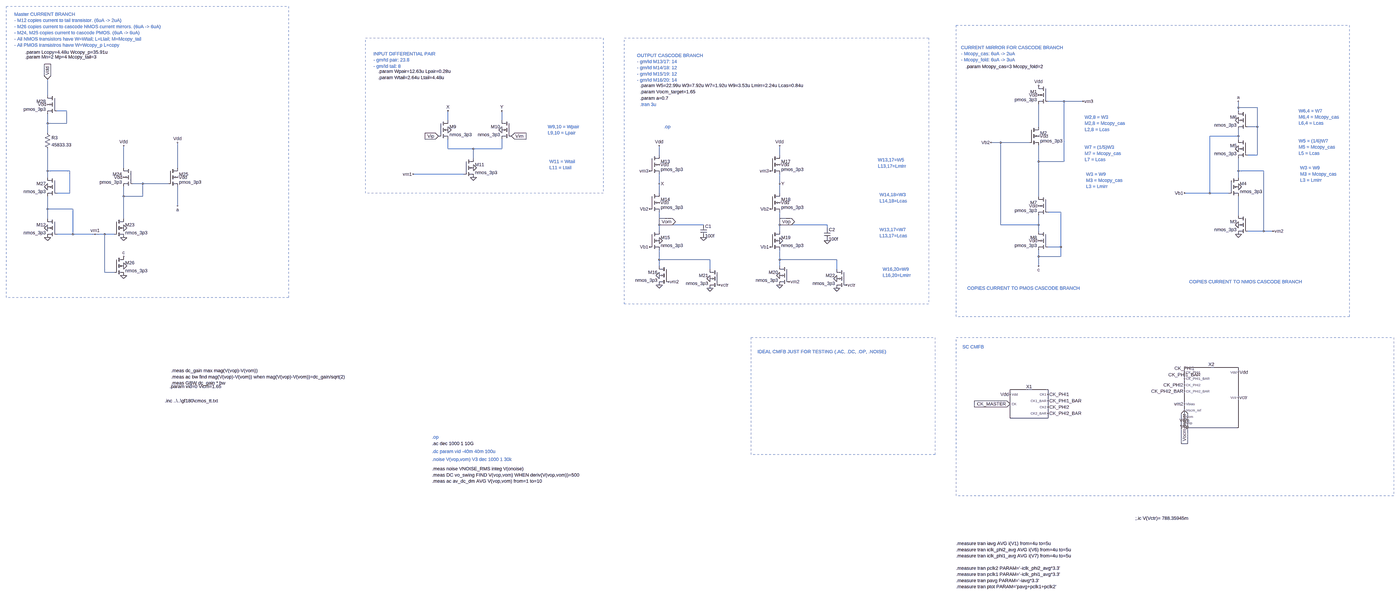
[diagram p0: schematic ota_v4.asc, whole sheet]
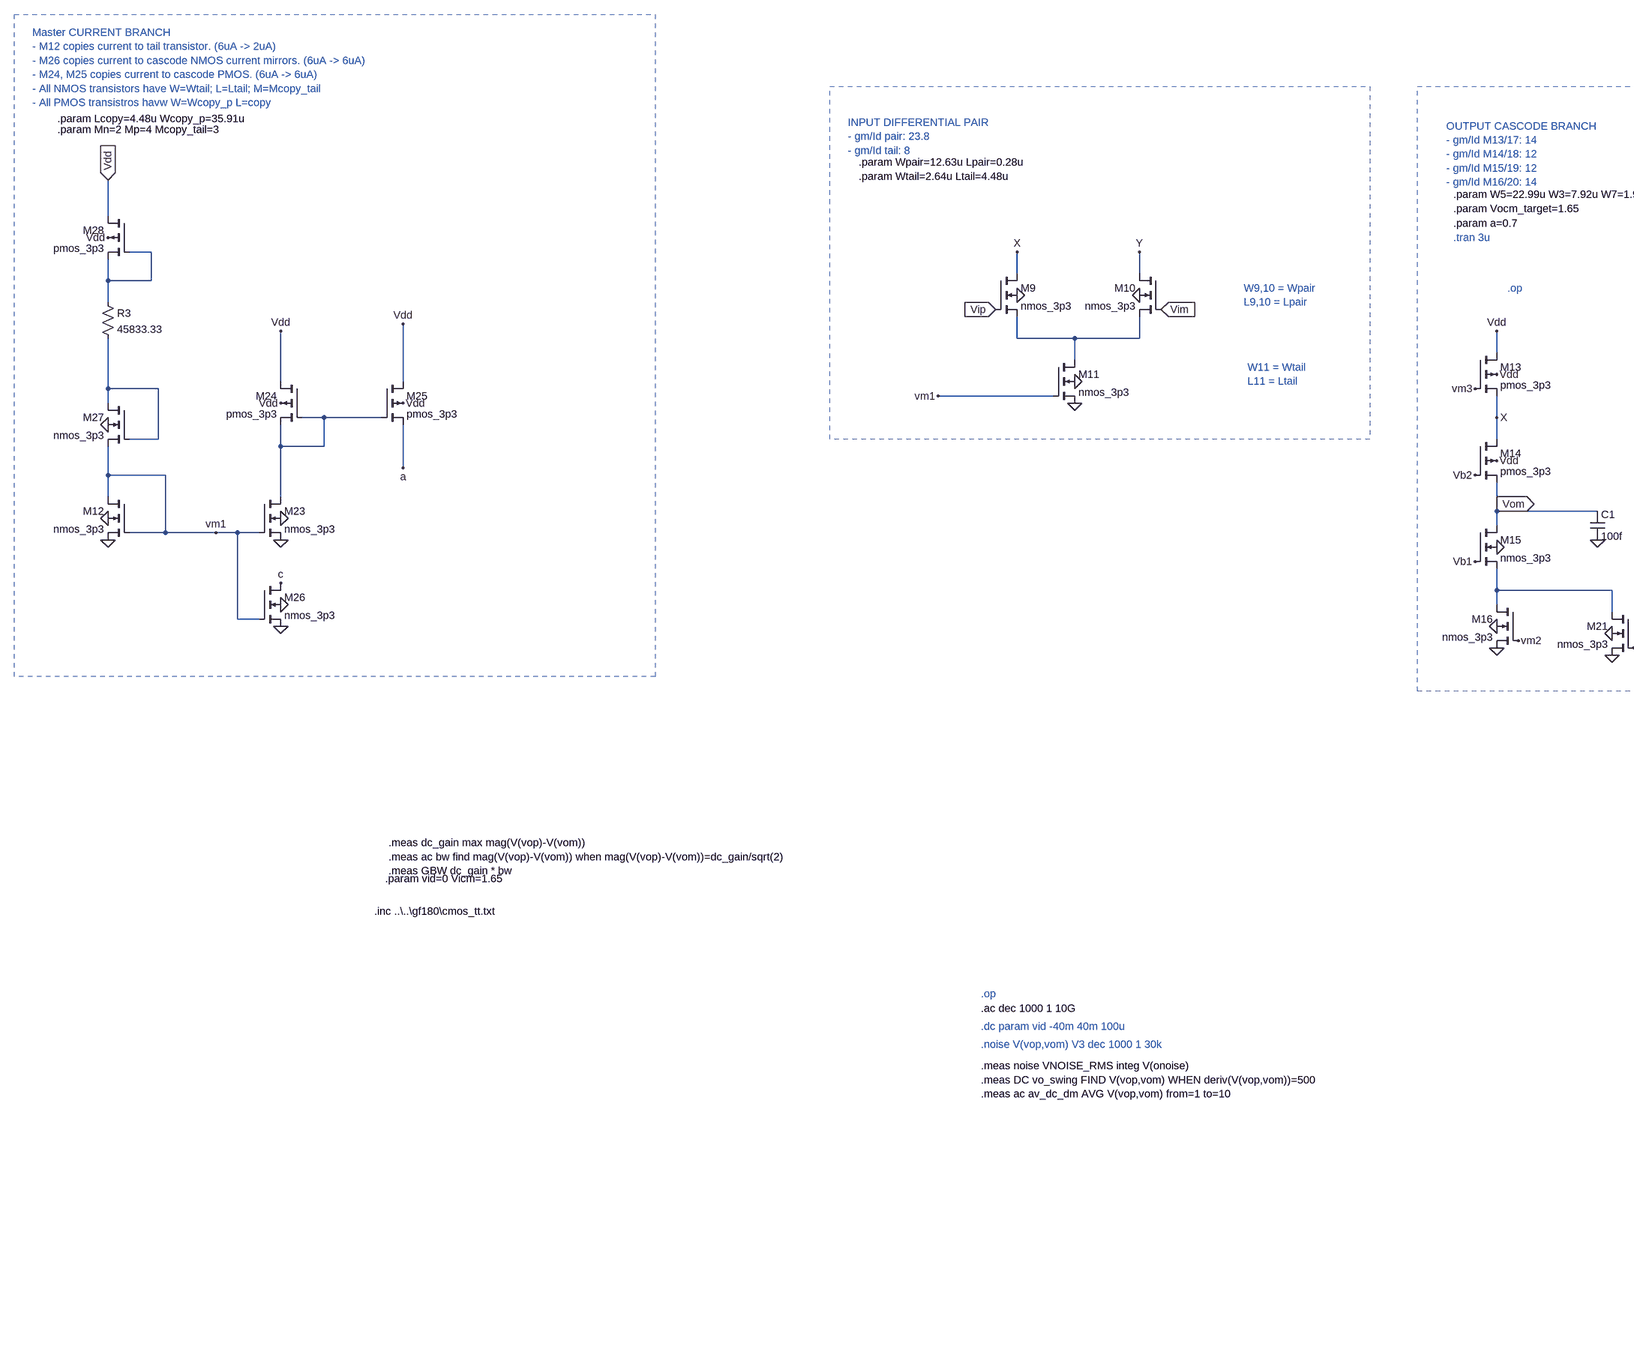
[diagram p1: schematic ota_v4.asc, part, row 1 of 1, column 1 of 2]
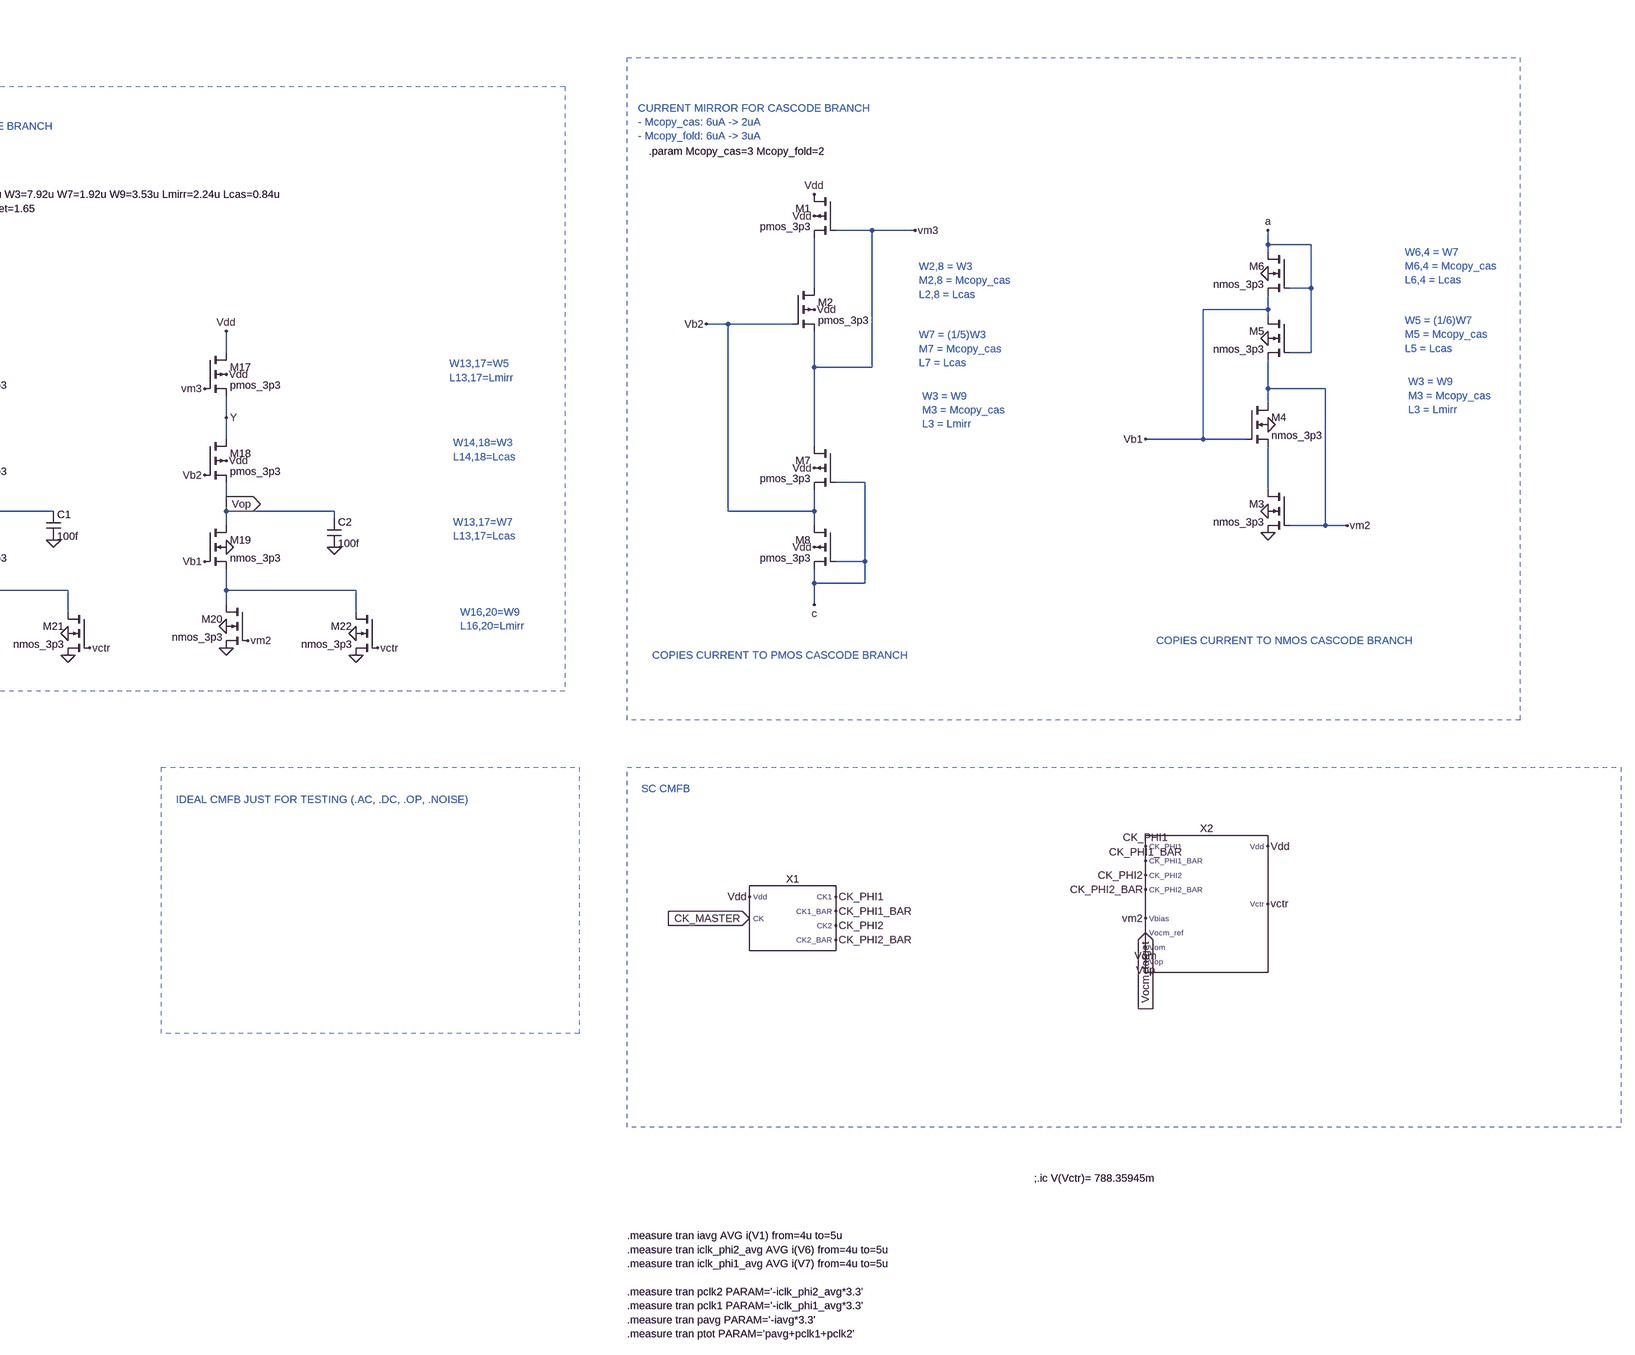
[diagram p2: schematic ota_v4.asc, part, row 1 of 1, column 2 of 2]
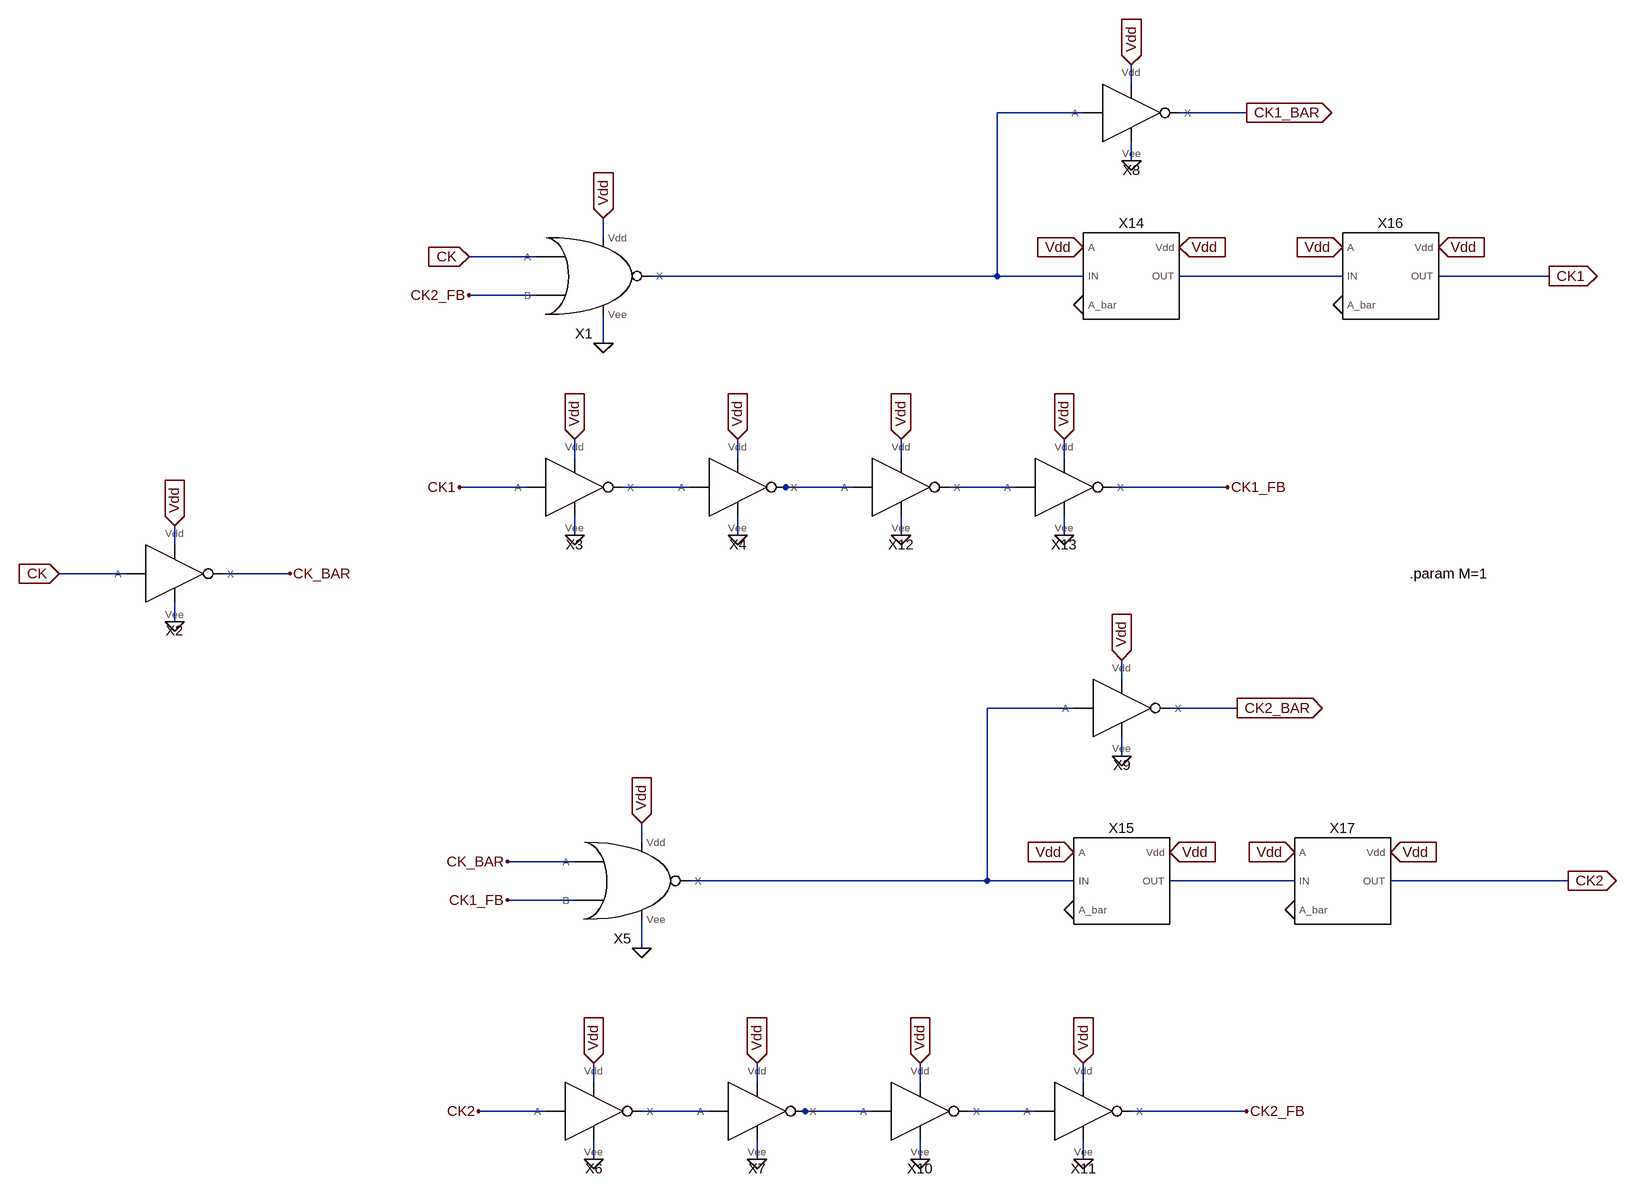
[diagram p3: sub-circuit phase_gen.asc]
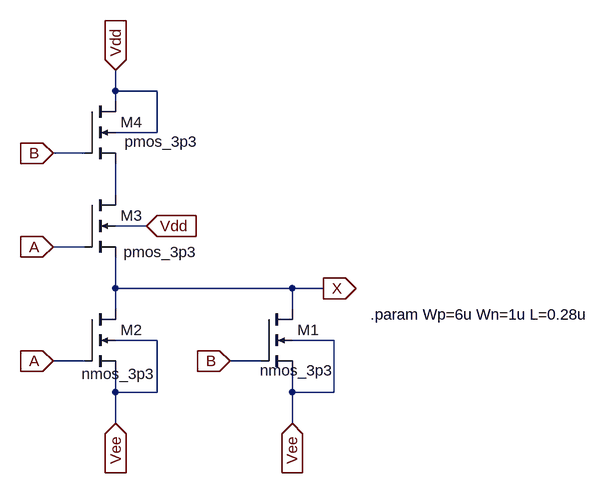
[diagram p4: sub-circuit nor2x1.asc]
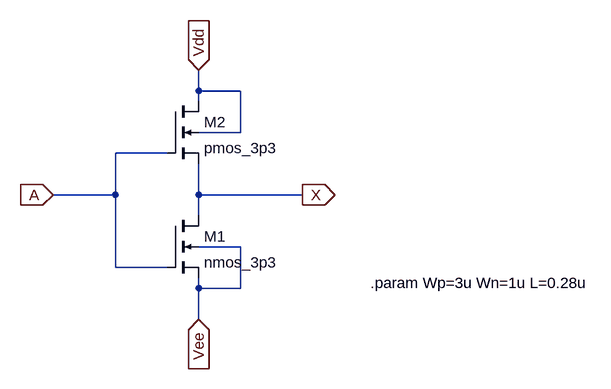
[diagram p5: sub-circuit invx1.asc]
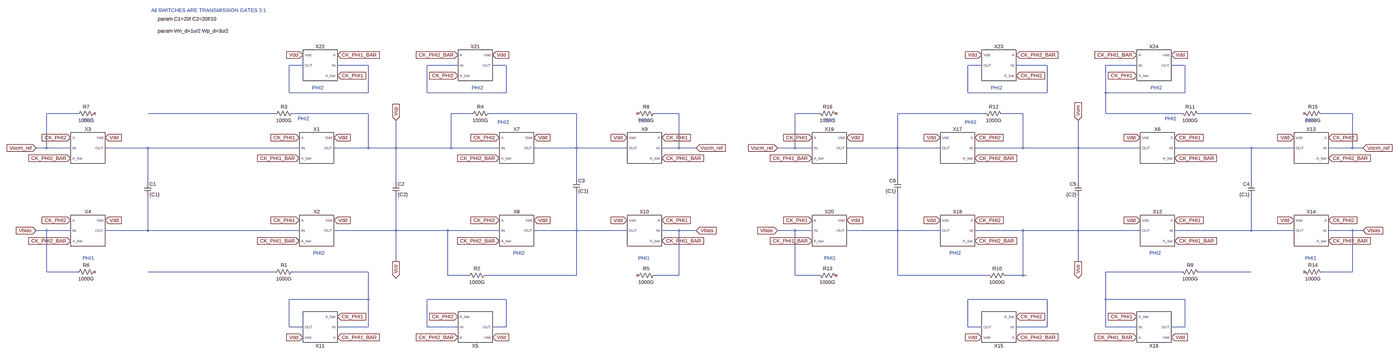
[diagram p6: sub-circuit cs_cmfb_v2.asc, whole sheet]
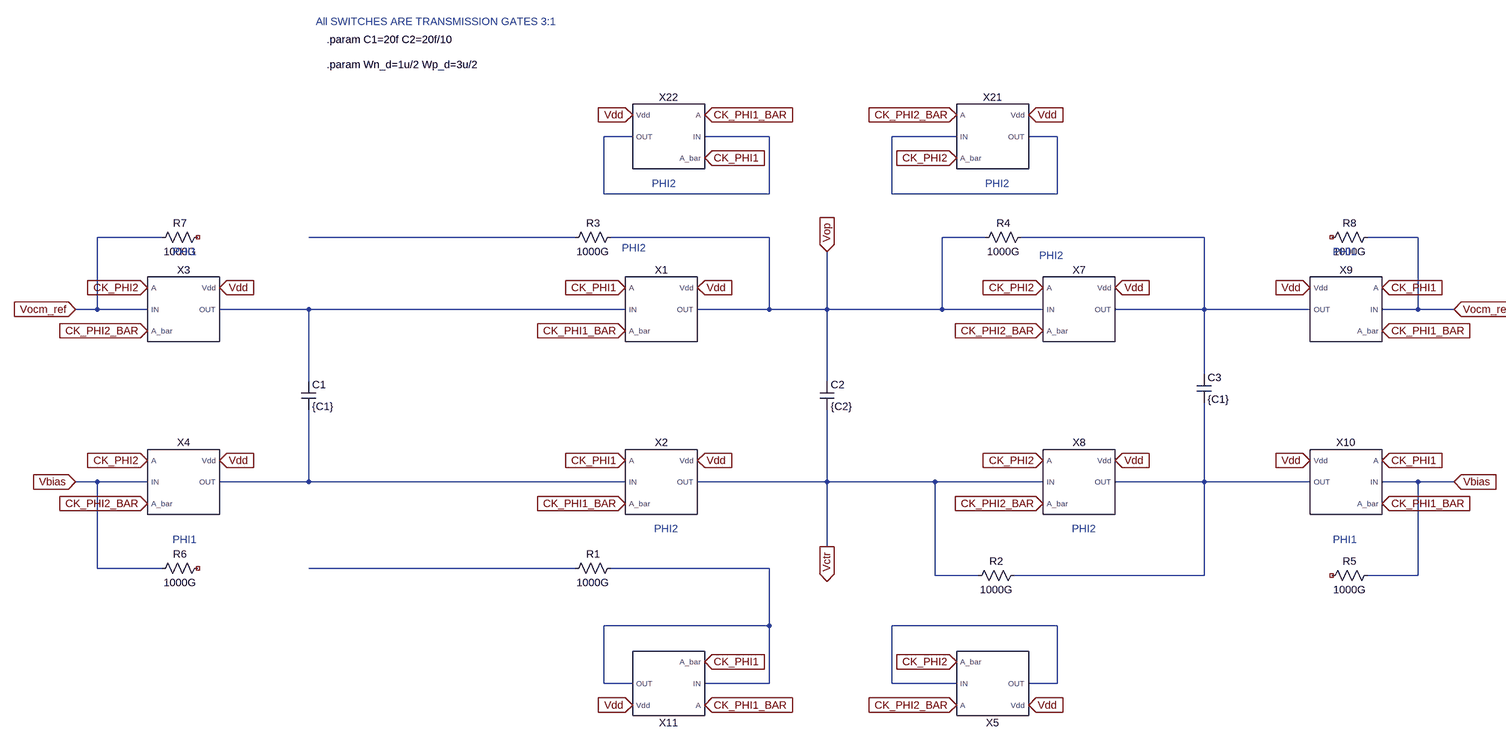
[diagram p7: sub-circuit cs_cmfb_v2.asc, part, row 1 of 1, column 1 of 2]
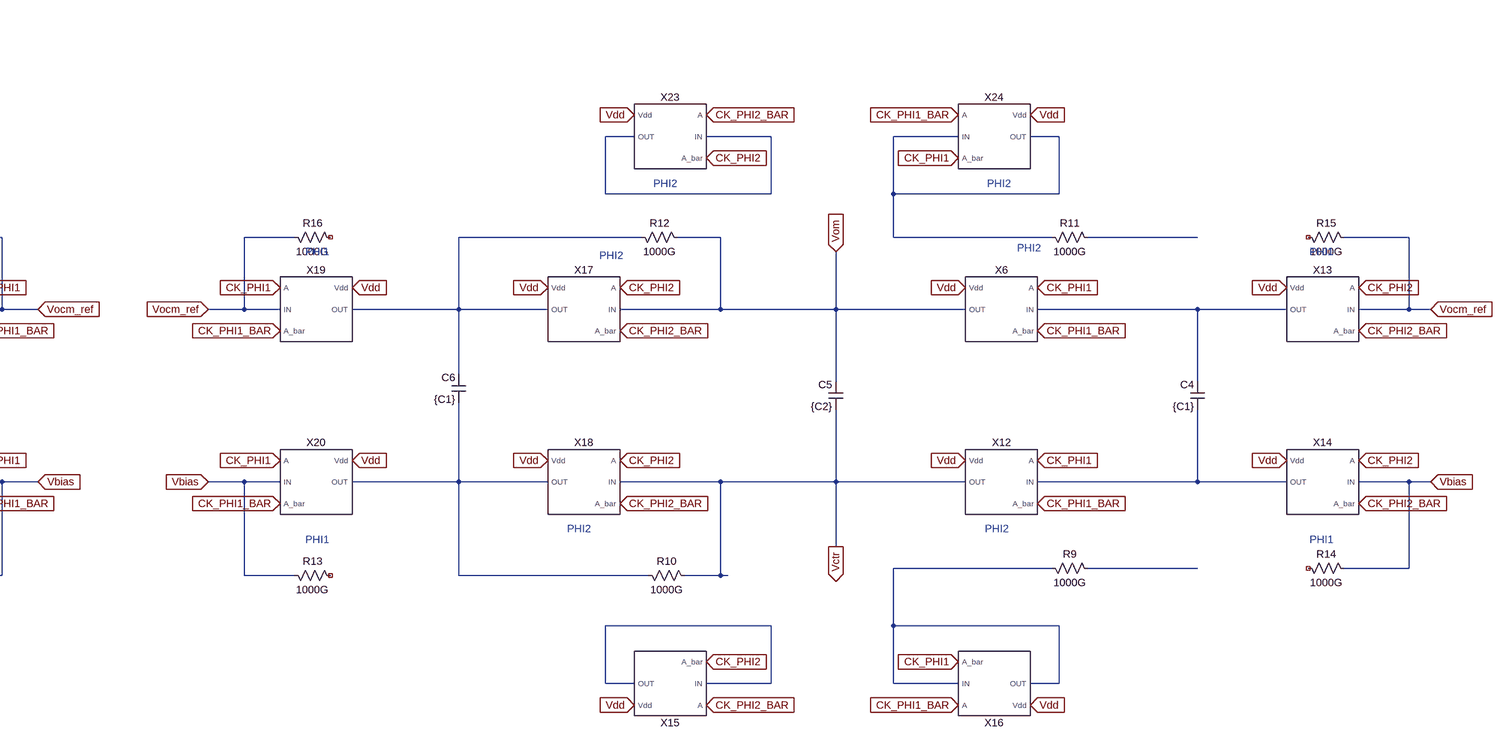
[diagram p8: sub-circuit cs_cmfb_v2.asc, part, row 1 of 1, column 2 of 2]
ota_v4.asc, the LTspice schematic file:
Version 4
SHEET 1 2504 3056
WIRE -7104 -480 -7104 -560
WIRE -1328 -448 -1408 -448
WIRE -1232 -448 -1328 -448
WIRE -448 -416 -448 -448
WIRE -352 -416 -448 -416
WIRE -7008 -400 -7056 -400
WIRE -448 -400 -448 -416
WIRE -5040 -352 -5040 -400
WIRE -4768 -352 -4768 -400
WIRE -7104 -336 -7104 -384
WIRE -7008 -336 -7008 -400
WIRE -7008 -336 -7104 -336
WIRE -1456 -320 -1456 -432
WIRE -352 -320 -352 -416
WIRE -352 -320 -400 -320
WIRE -7104 -288 -7104 -336
WIRE -448 -272 -448 -304
WIRE -448 -272 -592 -272
WIRE -448 -256 -448 -272
WIRE -1648 -240 -1696 -240
WIRE -1504 -240 -1648 -240
WIRE -5040 -208 -5040 -256
WIRE -4912 -208 -5040 -208
WIRE -4768 -208 -4768 -256
WIRE -4768 -208 -4912 -208
WIRE -3824 -176 -3824 -224
WIRE -3216 -176 -3216 -224
WIRE -352 -176 -352 -320
WIRE -352 -176 -400 -176
WIRE -4912 -160 -4912 -208
WIRE -1456 -144 -1456 -224
WIRE -1328 -144 -1328 -448
WIRE -1328 -144 -1456 -144
WIRE -6720 -112 -6720 -224
WIRE -6448 -112 -6448 -240
WIRE -7104 -96 -7104 -208
WIRE -6992 -96 -7104 -96
WIRE -448 -96 -448 -160
WIRE -320 -96 -448 -96
WIRE -4960 -80 -5216 -80
WIRE -7104 -64 -7104 -96
WIRE -448 -64 -448 -96
WIRE -6624 -32 -6672 -32
WIRE -6496 -32 -6624 -32
WIRE -3824 -32 -3824 -80
WIRE -3216 -32 -3216 -80
WIRE -6992 16 -6992 -96
WIRE -6992 16 -7056 16
WIRE -3824 16 -3824 -32
WIRE -3216 16 -3216 -32
WIRE -592 16 -592 -272
WIRE -592 16 -720 16
WIRE -496 16 -592 16
WIRE -6720 32 -6720 -16
WIRE -6624 32 -6624 -32
WIRE -6624 32 -6720 32
WIRE -1456 32 -1456 -144
WIRE -6448 80 -6448 -16
WIRE -7104 96 -7104 32
WIRE -6976 96 -7104 96
WIRE -1344 112 -1408 112
WIRE -448 128 -448 32
WIRE -7104 144 -7104 96
WIRE -6720 144 -6720 32
WIRE -3824 160 -3824 112
WIRE -3216 160 -3216 112
WIRE -3824 176 -3824 160
WIRE -3600 176 -3824 176
WIRE -3216 176 -3216 160
WIRE -2976 176 -3216 176
WIRE -1648 176 -1648 -240
WIRE -1456 176 -1456 128
WIRE -1456 176 -1648 176
WIRE -2976 192 -2976 176
WIRE -3824 208 -3824 176
WIRE -3216 208 -3216 176
WIRE -1456 208 -1456 176
WIRE -320 208 -320 -96
WIRE -320 208 -400 208
WIRE -272 208 -320 208
WIRE -6976 224 -6976 96
WIRE -6976 224 -7056 224
WIRE -6864 224 -6976 224
WIRE -6816 224 -6864 224
WIRE -6768 224 -6816 224
WIRE -1344 288 -1344 112
WIRE -1344 288 -1408 288
WIRE -1456 336 -1456 304
WIRE -1344 336 -1344 288
WIRE -1344 336 -1456 336
WIRE -3824 352 -3824 304
WIRE -3568 352 -3824 352
WIRE -3216 352 -3216 304
WIRE -2928 352 -3216 352
WIRE -3824 384 -3824 352
WIRE -3216 384 -3216 352
WIRE -1456 384 -1456 336
WIRE -3568 400 -3568 352
WIRE -2928 400 -2928 352
WIRE -6816 416 -6816 224
WIRE -6768 416 -6816 416
FLAG -1456 -480 Vdd
FLAG -1456 -528 Vdd
FLAG -1456 -272 Vdd
FLAG -1232 -448 vm3
FLAG -1696 -240 Vb2
FLAG -1456 384 c
FLAG -448 224 0
FLAG -448 176 0
FLAG -272 208 vm2
FLAG -448 -16 0
FLAG -720 16 Vb1
FLAG -448 -448 a
FLAG -448 -208 0
FLAG -448 -352 0
FLAG -1456 80 Vdd
FLAG -1456 256 Vdd
FLAG -4912 -64 0
FLAG -5040 -304 0
FLAG -4768 -304 0
FLAG -4912 -112 0
FLAG -7104 240 0
FLAG -7104 192 0
FLAG -5088 -272 Vip
IOPIN -5088 -272 In
FLAG -4720 -272 Vim
IOPIN -4720 -272 In
FLAG -3824 -224 Vdd
FLAG -3824 480 0
FLAG -3824 432 0
FLAG -3824 256 0
FLAG -3824 -32 X
FLAG -3824 64 Vdd
FLAG -3872 288 Vb1
FLAG -3872 96 Vb2
FLAG -3824 -128 Vdd
FLAG -3216 -224 Vdd
FLAG -3216 480 0
FLAG -3216 432 0
FLAG -3216 256 0
FLAG -3216 -32 Y
FLAG -3216 64 Vdd
FLAG -3264 288 Vb1
FLAG -3264 96 Vb2
FLAG -3216 -128 Vdd
FLAG -3168 464 vm2
FLAG -3776 464 vm2
FLAG -3264 -96 vm3
FLAG -3872 -96 vm3
FLAG -3216 160 Vop
IOPIN -3216 160 Out
FLAG -3824 160 Vom
IOPIN -3824 160 Out
FLAG -5040 -400 X
FLAG -4768 -400 Y
FLAG -6864 224 vm1
FLAG -3568 496 0
FLAG -3568 448 0
FLAG -3520 480 vctr
FLAG -2928 496 0
FLAG -2928 448 0
FLAG -2880 480 vctr
FLAG -3600 240 0
FLAG -2976 256 0
FLAG -5216 -80 vm1
FLAG -6720 240 0
FLAG -6720 192 0
FLAG -6720 -64 Vdd
FLAG -6720 -224 Vdd
FLAG -6448 -64 Vdd
FLAG -6448 -240 Vdd
FLAG -6448 80 a
FLAG -6720 432 0
FLAG -6720 384 0
FLAG -6720 336 c
FLAG -7104 -560 Vdd
IOPIN -7104 -560 In
FLAG -7104 -16 0
FLAG -7104 -432 Vdd
FLAG -1600 1088 Vdd
FLAG -1600 1136 CK_MASTER
IOPIN -1600 1136 In
FLAG -1408 1088 CK_PHI1
FLAG -1408 1152 CK_PHI2
FLAG -1408 1120 CK_PHI1_BAR
FLAG -1408 1184 CK_PHI2_BAR
FLAG -720 976 CK_PHI1
FLAG -720 1040 CK_PHI2
FLAG -720 1008 CK_PHI1_BAR
FLAG -720 1072 CK_PHI2_BAR
FLAG -720 1232 Vop
FLAG -720 1200 Vom
FLAG -720 1168 Vocm_target
IOPIN -720 1168 In
FLAG -720 1136 vm2
FLAG -448 1104 vctr
FLAG -448 976 Vdd
DATAFLAG -5056 -80 ""
DATAFLAG -1600 -240 ""
DATAFLAG -1344 -448 ""
DATAFLAG -640 16 ""
DATAFLAG -336 208 ""
DATAFLAG -3728 176 ""
DATAFLAG -4896 -208 ""
DATAFLAG -3664 352 ""
DATAFLAG -3344 192 "Id(M18)"
DATAFLAG -3360 -128 "Id(M17)"
DATAFLAG -4752 -112 "Id(M11)"
DATAFLAG -5168 -384 "Id(M9)"
DATAFLAG -4672 -400 "Id(M9)"
DATAFLAG -3744 -16 "V(X)"
DATAFLAG -3344 384 "Id(M20)"
DATAFLAG -2816 384 "Id(M22)"
DATAFLAG -6976 176 ""
DATAFLAG -6448 48 "Id(M25)"
DATAFLAG -6720 304 "Id(M26)"
DATAFLAG -448 -480 "Id(M6)"
DATAFLAG -1456 432 "Id(M6)"
DATAFLAG -3744 464 ""
SYMBOL pmos4 -1408 -528 M0
SYMATTR InstName M1
SYMATTR Value pmos_3p3
SYMATTR Value2 l='Lmirr' w='W5' m=Mcopy_fold
SYMBOL pmos4 -1504 -320 R0
SYMATTR InstName M2
SYMATTR Value pmos_3p3
SYMATTR Value2 l='Lcas' w='W3' m=Mcopy_cas
SYMBOL nmos4 -400 128 M0
SYMATTR InstName M3
SYMATTR Value nmos_3p3
SYMATTR Value2 l='Lmirr' w='W9' m=Mcopy_cas
SYMBOL nmos4 -496 -64 R0
SYMATTR InstName M4
SYMATTR Value nmos_3p3
SYMATTR Value2 l='Lcas' w='W7' m=Mcopy_cas
SYMBOL nmos4 -400 -256 M0
SYMATTR InstName M5
SYMATTR Value nmos_3p3
SYMATTR Value2 l='Lcas' w='(1/6)*W7' m=Mcopy_cas
SYMBOL nmos4 -400 -400 M0
SYMATTR InstName M6
SYMATTR Value nmos_3p3
SYMATTR Value2 l='Lcas' w='W7' m=Mcopy_cas
SYMBOL pmos4 -1408 32 M0
SYMATTR InstName M7
SYMATTR Value pmos_3p3
SYMATTR Value2 l='Lcas' w='(1/5)*W3' m=Mcopy_cas
SYMBOL pmos4 -1408 208 M0
SYMATTR InstName M8
SYMATTR Value pmos_3p3
SYMATTR Value2 l='Lcas' w='W3' m=Mcopy_cas
SYMBOL nmos4 -5088 -352 R0
SYMATTR InstName M9
SYMATTR Value nmos_3p3
SYMATTR Value2 l='Lpair' w='Wpair' m=1
SYMBOL nmos4 -4720 -352 M0
SYMATTR InstName M10
SYMATTR Value nmos_3p3
SYMATTR Value2 l='Lpair' w='Wpair' m=1
SYMBOL nmos4 -4960 -160 R0
SYMATTR InstName M11
SYMATTR Value nmos_3p3
SYMATTR Value2 l='Ltail' w='Wtail' m=1
SYMBOL nmos4 -7056 144 M0
SYMATTR InstName M12
SYMATTR Value nmos_3p3
SYMATTR Value2 l='Ltail' w='Wtail' m=Mcopy_tail
SYMBOL pmos4 -3872 -176 R0
SYMATTR InstName M13
SYMATTR Value pmos_3p3
SYMATTR Value2 l='Lmirr' w='W5' m=1
SYMBOL pmos4 -3872 16 R0
SYMATTR InstName M14
SYMATTR Value pmos_3p3
SYMATTR Value2 l='Lcas' w='W3' m=1
SYMBOL nmos4 -3872 208 R0
SYMATTR InstName M15
SYMATTR Value nmos_3p3
SYMATTR Value2 l='Lcas' w='W7'
SYMBOL nmos4 -3776 384 M0
SYMATTR InstName M16
SYMATTR Value nmos_3p3
SYMATTR Value2 l='Lmirr' w='a*W9'
SYMBOL pmos4 -3264 -176 R0
SYMATTR InstName M17
SYMATTR Value pmos_3p3
SYMATTR Value2 l='Lmirr' w='W5' m=1
SYMBOL pmos4 -3264 16 R0
SYMATTR InstName M18
SYMATTR Value pmos_3p3
SYMATTR Value2 l='Lcas' w='W3' m=1
SYMBOL nmos4 -3264 208 R0
SYMATTR InstName M19
SYMATTR Value nmos_3p3
SYMATTR Value2 l='Lcas' w='W7'
SYMBOL nmos4 -3168 384 M0
SYMATTR InstName M20
SYMATTR Value nmos_3p3
SYMATTR Value2 l='Lmirr' w='a*W9'
SYMBOL nmos4 -3520 400 M0
SYMATTR InstName M21
SYMATTR Value nmos_3p3
SYMATTR Value2 l='Lmirr' w='(1-a)*W9'
SYMBOL nmos4 -2880 400 M0
SYMATTR InstName M22
SYMATTR Value nmos_3p3
SYMATTR Value2 l='Lmirr' w='(1-a)*W9'
SYMBOL cap -3616 176 R0
SYMATTR InstName C1
SYMATTR Value 100f
SYMBOL cap -2992 192 R0
SYMATTR InstName C2
SYMATTR Value 100f
SYMBOL nmos4 -6768 144 R0
SYMATTR InstName M23
SYMATTR Value nmos_3p3
SYMATTR Value2 l='Ltail' w='Wtail' m=Mcopy_tail
SYMBOL pmos4 -6672 -112 M0
SYMATTR InstName M24
SYMATTR Value pmos_3p3
SYMATTR Value2 l='Lcopy' w='Wcopy_p'
SYMBOL pmos4 -6496 -112 R0
SYMATTR InstName M25
SYMATTR Value pmos_3p3
SYMATTR Value2 l='Lcopy' w='Wcopy_p'
SYMBOL nmos4 -6768 336 R0
SYMATTR InstName M26
SYMATTR Value nmos_3p3
SYMATTR Value2 l='Ltail' w='Wtail' m=Mcopy_tail
SYMBOL nmos4 -7056 -64 M0
SYMATTR InstName M27
SYMATTR Value nmos_3p3
SYMATTR Value2 l='Ltail' w=2.64u m=3
SYMBOL pmos4 -7056 -480 M0
SYMATTR InstName M28
SYMATTR Value pmos_3p3
SYMATTR Value2 l='Ltail' w='Wcopy_p'
SYMBOL res -7120 -304 R0
SYMATTR InstName R3
SYMATTR Value 45833.33
SYMBOL PHASE_GEN -1504 1136 R0
SYMATTR InstName X1
SYMBOL CS_CMFB_V2 -592 1104 R0
SYMATTR InstName X2
TEXT -5392 -600 Left 2 !.param Wpair=12.63u Lpair=0.28u
TEXT -5392 -568 Left 2 !.param Wtail=2.64u Ltail=4.48u
TEXT -6488 1048 Left 2 !.param vid=0 Vicm=1.65
TEXT -6512 1120 Left 2 !.inc ..\\..\\gf180\\cmos_tt.txt
TEXT -3800 -320 Left 2 ;.op
TEXT -3920 -528 Left 2 !.param W5=22.99u W3=7.92u W7=1.92u W9=3.53u Lmirr=2.24u Lcas=0.84u
TEXT -3920 -496 Left 2 !.param Vocm_target=1.65
TEXT -3920 -432 Left 2 ;.tran 3u
TEXT -3920 -464 Left 2 !.param a=0.7
TEXT -5120 1336 Left 2 !.ac dec 1000 1 10G
TEXT -5120 1376 Left 2 ;.dc param vid -40m 40m 100u
TEXT -6480 968 Left 2 !.meas dc_gain max mag(V(vop)-V(vom))\n.meas ac bw find mag(V(vop)-V(vom)) when mag(V(vop)-V(vom))=dc_gain/sqrt(2)\n.meas GBW dc_gain * bw
TEXT -7216 -696 Left 2 !.param Lcopy=4.48u Wcopy_p=35.91u
TEXT -7272 -888 Left 2 ;Master CURRENT BRANCH\n- M12 copies current to tail transistor. (6uA -> 2uA)\n- M26 copies current to cascode NMOS current mirrors. (6uA -> 6uA)\n- M24, M25 copies current to cascode PMOS. (6uA -> 6uA)\n- All NMOS transistors have W=Wtail; L=Ltail; M=Mcopy_tail\n- All PMOS transistros havw W=Wcopy_p L=copy
TEXT -5416 -688 Left 2 ;INPUT DIFFERENTIAL PAIR\n- gm/Id pair: 23.8\n- gm/Id tail: 8
TEXT -5120 1416 Left 2 ;.noise V(vop,vom) V3 dec 1000 1 30k
TEXT -5120 1464 Left 2 !.meas noise VNOISE_RMS integ V(onoise)\n.meas DC vo_swing FIND V(vop,vom) WHEN deriv(V(vop,vom))=500\n.meas ac av_dc_dm AVG V(vop,vom) from=1 to=10
TEXT -7216 -672 Left 2 !.param Mn=2 Mp=4 Mcopy_tail=3
TEXT -1824 -624 Left 2 !.param Mcopy_cas=3 Mcopy_fold=2
TEXT -1848 -720 Left 2 ;CURRENT MIRROR FOR CASCODE BRANCH\n- Mcopy_cas: 6uA -> 2uA\n- Mcopy_fold: 6uA -> 3uA
TEXT -1816 496 Left 2 ;COPIES CURRENT TO PMOS CASCODE BRANCH
TEXT -696 464 Left 2 ;COPIES CURRENT TO NMOS CASCODE BRANCH
TEXT -1872 1888 Left 2 !.measure tran iavg AVG i(V1) from=4u to=5u\n.measure tran iclk_phi2_avg AVG i(V6) from=4u to=5u\n.measure tran iclk_phi1_avg AVG i(V7) from=4u to=5u\n \n.measure tran pclk2 PARAM='-iclk_phi2_avg*3.3'\n.measure tran pclk1 PARAM='-iclk_phi1_avg*3.3'\n.measure tran pavg PARAM='-iavg*3.3'\n.measure tran ptot PARAM='pavg+pclk1+pclk2'
TEXT -3936 -680 Left 2 ;OUTPUT CASCODE BRANCH\n- gm/Id M13/17: 14\n- gm/Id M14/18: 12\n- gm/Id M15/19: 12\n- gm/Id M16/20: 14
TEXT -1840 848 Left 2 ;SC CMFB
TEXT -3328 872 Left 2 ;IDEAL CMFB JUST FOR TESTING (.AC, .DC, .OP, .NOISE)
TEXT -2720 -152 Left 2 ;W13,17=W5\nL13,17=Lmirr
TEXT -2712 24 Left 2 ;W14,18=W3\nL14,18=Lcas
TEXT -2712 200 Left 2 ;W13,17=W7\nL13,17=Lcas
TEXT -2696 400 Left 2 ;W16,20=W9\nL16,20=Lmirr
TEXT -144 -400 Left 2 ;W6,4 = W7\nM6,4 = Mcopy_cas\nL6,4 = Lcas
TEXT -144 -248 Left 2 ;W5 = (1/6)W7\nM5 = Mcopy_cas\nL5 = Lcas
TEXT -136 -112 Left 2 ;W3 = W9\nM3 = Mcopy_cas\nL3 = Lmirr
TEXT -1224 -368 Left 2 ;W2,8 = W3\nM2,8 = Mcopy_cas\nL2,8 = Lcas
TEXT -1224 -216 Left 2 ;W7 = (1/5)W3\nM7 = Mcopy_cas\nL7 = Lcas
TEXT -1216 -80 Left 2 ;W3 = W9\nM3 = Mcopy_cas\nL3 = Lmirr
TEXT -4536 -320 Left 2 ;W9,10 = Wpair\nL9,10 = Lpair
TEXT -4528 -144 Left 2 ;W11 = Wtail\nL11 = Ltail
TEXT -5120 1304 Left 2 ;.op
TEXT -968 1744 Left 2 !;.ic V(Vctr)= 788.35945m
RECTANGLE Normal -2464 576 -4000 -768 2
RECTANGLE Normal 112 640 -1872 -832 2
RECTANGLE Normal 336 1600 -1872 800 2
RECTANGLE Normal -4256 16 -5456 -768 2
RECTANGLE Normal -5888 544 -7312 -928 2
RECTANGLE Normal -2432 1392 -3360 800 2

phase_gen.asc, the sub-circuit schematic file:
Version 4
SHEET 1 3208 1200
WIRE 1856 -656 1856 -688
WIRE 1776 -608 1632 -608
WIRE 2048 -608 1936 -608
WIRE 1856 -528 1856 -560
WIRE 976 -400 976 -432
WIRE 864 -368 752 -368
WIRE 1632 -336 1632 -608
WIRE 1632 -336 1056 -336
WIRE 1776 -336 1632 -336
WIRE 2208 -336 1936 -336
WIRE 2752 -336 2368 -336
WIRE 864 -304 752 -304
WIRE 976 -224 976 -272
WIRE 928 -32 928 -64
WIRE 1200 -32 1200 -64
WIRE 1472 -32 1472 -64
WIRE 1744 -32 1744 -64
WIRE 848 16 736 16
WIRE 1120 16 1008 16
WIRE 1280 16 1264 16
WIRE 1392 16 1280 16
WIRE 1664 16 1552 16
WIRE 2016 16 1824 16
WIRE 928 96 928 64
WIRE 1200 96 1200 64
WIRE 1472 96 1472 64
WIRE 1744 96 1744 64
WIRE -192 112 -192 80
WIRE -272 160 -384 160
WIRE 0 160 -112 160
WIRE -192 240 -192 208
WIRE 1840 336 1840 304
WIRE 1760 384 1616 384
WIRE 2032 384 1920 384
WIRE 1840 464 1840 432
WIRE 1040 608 1040 576
WIRE 928 640 816 640
WIRE 1616 672 1616 384
WIRE 1616 672 1120 672
WIRE 1760 672 1616 672
WIRE 2128 672 1920 672
WIRE 2784 672 2288 672
WIRE 928 704 816 704
WIRE 1040 784 1040 736
WIRE 960 1008 960 976
WIRE 1232 1008 1232 976
WIRE 1504 1008 1504 976
WIRE 1776 1008 1776 976
WIRE 880 1056 768 1056
WIRE 1152 1056 1040 1056
WIRE 1312 1056 1296 1056
WIRE 1424 1056 1312 1056
WIRE 1696 1056 1584 1056
WIRE 2048 1056 1856 1056
WIRE 960 1136 960 1104
WIRE 1232 1136 1232 1104
WIRE 1504 1136 1504 1104
WIRE 1776 1136 1776 1104
FLAG 752 -368 CK
IOPIN 752 -368 In
FLAG 976 -224 0
FLAG -384 160 CK
IOPIN -384 160 In
FLAG 0 160 CK_BAR
FLAG -192 80 Vdd
IOPIN -192 80 In
FLAG 976 -432 Vdd
IOPIN 976 -432 In
FLAG -192 240 0
FLAG 2752 -336 CK1
IOPIN 2752 -336 Out
FLAG 816 640 CK_BAR
FLAG 1040 784 0
FLAG 1040 576 Vdd
IOPIN 1040 576 In
FLAG 768 1056 CK2
FLAG 960 976 Vdd
IOPIN 960 976 In
FLAG 960 1136 0
FLAG 1232 976 Vdd
IOPIN 1232 976 In
FLAG 1232 1136 0
FLAG 816 704 CK1_FB
FLAG 752 -304 CK2_FB
FLAG 1856 -688 Vdd
IOPIN 1856 -688 In
FLAG 1856 -528 0
FLAG 2048 -608 CK1_BAR
IOPIN 2048 -608 Out
FLAG 2784 672 CK2
IOPIN 2784 672 Out
FLAG 1840 304 Vdd
IOPIN 1840 304 In
FLAG 1840 464 0
FLAG 2048 1056 CK2_FB
FLAG 1504 976 Vdd
IOPIN 1504 976 In
FLAG 1504 1136 0
FLAG 1776 976 Vdd
IOPIN 1776 976 In
FLAG 1776 1136 0
FLAG 736 16 CK1
FLAG 928 -64 Vdd
IOPIN 928 -64 In
FLAG 928 96 0
FLAG 1200 -64 Vdd
IOPIN 1200 -64 In
FLAG 1200 96 0
FLAG 2016 16 CK1_FB
FLAG 1472 -64 Vdd
IOPIN 1472 -64 In
FLAG 1472 96 0
FLAG 1744 -64 Vdd
IOPIN 1744 -64 In
FLAG 1744 96 0
FLAG 2032 384 CK2_BAR
IOPIN 2032 384 Out
FLAG 1936 -384 Vdd
IOPIN 1936 -384 In
FLAG 1776 -384 Vdd
IOPIN 1776 -384 In
FLAG 1920 624 Vdd
IOPIN 1920 624 In
FLAG 1760 624 Vdd
IOPIN 1760 624 In
FLAG 1760 720 0
FLAG 1776 -288 0
FLAG 2368 -384 Vdd
IOPIN 2368 -384 In
FLAG 2208 -384 Vdd
IOPIN 2208 -384 In
FLAG 2208 -288 0
FLAG 2288 624 Vdd
IOPIN 2288 624 In
FLAG 2128 624 Vdd
IOPIN 2128 624 In
FLAG 2128 720 0
SYMBOL NOR2x1 944 -336 R0
SYMATTR InstName X1
SYMBOL INVx1 -192 160 R0
SYMATTR InstName X2
SYMBOL NOR2x1 1008 672 R0
SYMATTR InstName X5
SYMBOL INVx1 960 1056 R0
SYMATTR InstName X6
SYMBOL INVx1 1232 1056 R0
SYMATTR InstName X7
SYMBOL INVx1 1856 -608 R0
SYMATTR InstName X8
SYMBOL INVx1 1840 384 R0
SYMATTR InstName X9
SYMBOL INVx1 1504 1056 R0
SYMATTR InstName X10
SYMBOL INVx1 1776 1056 R0
SYMATTR InstName X11
SYMBOL INVx1 928 16 R0
SYMATTR InstName X3
SYMBOL INVx1 1200 16 R0
SYMATTR InstName X4
SYMBOL INVx1 1472 16 R0
SYMATTR InstName X12
SYMBOL INVx1 1744 16 R0
SYMATTR InstName X13
SYMBOL tgate 1856 -336 R0
SYMATTR InstName X14
SYMATTR SpiceLine L=0.28u Wn=1u Wp=3u M={M}
SYMBOL tgate 1840 672 R0
SYMATTR InstName X15
SYMATTR SpiceLine L=0.28u Wn=1u Wp=3u M={M}
SYMBOL tgate 2288 -336 R0
SYMATTR InstName X16
SYMATTR SpiceLine L=0.28u Wn=1u Wp=3u M={M}
SYMBOL tgate 2208 672 R0
SYMATTR InstName X17
SYMATTR SpiceLine L=0.28u Wn=1u Wp=3u M={M}
TEXT 2320 160 Left 2 !.param M=1

nor2x1.asc, the sub-circuit schematic file:
Version 4.1
SHEET 1 2956 680
WIRE 1680 -496 1680 -528
WIRE 1744 -496 1680 -496
WIRE 1680 -480 1680 -496
WIRE 1744 -432 1744 -496
WIRE 1744 -432 1680 -432
WIRE 1632 -400 1584 -400
WIRE 1680 -336 1680 -384
WIRE 1728 -288 1680 -288
WIRE 1632 -256 1584 -256
WIRE 1680 -192 1680 -240
WIRE 1952 -192 1680 -192
WIRE 2000 -192 1952 -192
WIRE 1680 -160 1680 -192
WIRE 1952 -160 1952 -192
WIRE 1744 -112 1680 -112
WIRE 2016 -112 1952 -112
WIRE 1632 -80 1584 -80
WIRE 1904 -80 1856 -80
WIRE 1680 -32 1680 -64
WIRE 1744 -32 1744 -112
WIRE 1744 -32 1680 -32
WIRE 1952 -32 1952 -64
WIRE 2016 -32 2016 -112
WIRE 2016 -32 1952 -32
WIRE 1680 16 1680 -32
WIRE 1952 16 1952 -32
FLAG 1584 -256 A
IOPIN 1584 -256 In
FLAG 2000 -192 X
IOPIN 2000 -192 Out
FLAG 1680 -528 Vdd
IOPIN 1680 -528 In
FLAG 1584 -80 A
IOPIN 1584 -80 In
FLAG 1856 -80 B
IOPIN 1856 -80 In
FLAG 1584 -400 B
IOPIN 1584 -400 In
FLAG 1952 16 Vee
IOPIN 1952 16 In
FLAG 1680 16 Vee
IOPIN 1680 16 In
FLAG 1728 -288 Vdd
IOPIN 1728 -288 In
SYMBOL nmos4 1904 -160 R0
WINDOW 3 -2 94 Left 2
SYMATTR Value nmos_3p3
SYMATTR InstName M1
SYMATTR Value2 l={L} w={Wn}
SYMBOL nmos4 1632 -336 R0
WINDOW 3 60 88 Left 2
SYMATTR Value pmos_3p3
SYMATTR InstName M3
SYMATTR Value2 l={L} w={Wp}
SYMBOL nmos4 1632 -480 R0
WINDOW 3 62 62 Left 2
SYMATTR Value pmos_3p3
SYMATTR InstName M4
SYMATTR Value2 l={L} w={Wp}
SYMBOL nmos4 1632 -160 R0
WINDOW 3 -4 100 Left 2
SYMATTR Value nmos_3p3
SYMATTR InstName M2
SYMATTR Value2 l={L} w={Wn}
TEXT 2072 -152 Left 2 !.param Wp=6u Wn=1u L=0.28u

invx1.asc, the sub-circuit schematic file:
Version 4.1
SHEET 1 2776 836
WIRE 416 -16 416 -48
WIRE 480 -16 416 -16
WIRE 416 0 416 -16
WIRE 480 48 480 -16
WIRE 480 48 416 48
WIRE 368 80 288 80
WIRE 288 144 288 80
WIRE 288 144 192 144
WIRE 416 144 416 96
WIRE 576 144 416 144
WIRE 416 176 416 144
WIRE 480 224 416 224
WIRE 288 256 288 144
WIRE 368 256 288 256
WIRE 416 288 416 272
WIRE 480 288 480 224
WIRE 480 288 416 288
WIRE 416 336 416 288
FLAG 416 -48 Vdd
IOPIN 416 -48 In
FLAG 192 144 A
IOPIN 192 144 In
FLAG 576 144 X
IOPIN 576 144 Out
FLAG 416 336 Vee
IOPIN 416 336 In
SYMBOL nmos4 368 176 R0
SYMATTR InstName M1
SYMATTR Value nmos_3p3
SYMATTR Value2 l={L} w={Wn}
SYMBOL nmos4 368 0 R0
SYMATTR InstName M2
SYMATTR Value pmos_3p3
SYMATTR Value2 l={L} w={Wp}
TEXT 680 280 Left 2 !.param Wp=3u Wn=1u L=0.28u

cs_cmfb_v2.asc, the sub-circuit schematic file:
Version 4
SHEET 1 4968 1400
WIRE -1040 -368 -1104 -368
WIRE -736 -368 -880 -368
WIRE -320 -368 -464 -368
WIRE -96 -368 -160 -368
WIRE 2672 -368 2608 -368
WIRE 2976 -368 2832 -368
WIRE 3392 -368 3248 -368
WIRE 3616 -368 3552 -368
WIRE -1104 -240 -1104 -368
WIRE -736 -240 -736 -368
WIRE -736 -240 -1104 -240
WIRE -464 -240 -464 -368
WIRE -96 -240 -96 -368
WIRE -96 -240 -464 -240
WIRE 2608 -240 2608 -368
WIRE 2976 -240 2976 -368
WIRE 2976 -240 2608 -240
WIRE 3248 -240 3248 -368
WIRE 3616 -240 3616 -368
WIRE 3616 -240 3248 -240
WIRE -2096 -144 -2240 -144
WIRE -1168 -144 -1760 -144
WIRE -736 -144 -1088 -144
WIRE -256 -144 -352 -144
WIRE 320 -144 -176 -144
WIRE 832 -144 720 -144
WIRE 1792 -144 1680 -144
WIRE 2688 -144 2192 -144
WIRE 2864 -144 2768 -144
WIRE 3248 -144 3248 -240
WIRE 3600 -144 3248 -144
WIRE 4272 -144 3680 -144
WIRE 4752 -144 4608 -144
WIRE -2240 16 -2240 -144
WIRE -2240 16 -2288 16
WIRE -2128 16 -2240 16
WIRE -1760 16 -1968 16
WIRE -1056 16 -1760 16
WIRE -736 16 -736 -144
WIRE -736 16 -896 16
WIRE -608 16 -608 -112
WIRE -608 16 -736 16
WIRE -352 16 -352 -144
WIRE -352 16 -608 16
WIRE -128 16 -352 16
WIRE 320 16 320 -144
WIRE 320 16 32 16
WIRE 592 16 320 16
WIRE 832 16 832 -144
WIRE 832 16 752 16
WIRE 912 16 832 16
WIRE 1680 16 1680 -144
WIRE 1680 16 1600 16
WIRE 1760 16 1680 16
WIRE 2192 16 2192 -144
WIRE 2192 16 1920 16
WIRE 2480 16 2192 16
WIRE 2864 16 2864 -144
WIRE 2864 16 2640 16
WIRE 3120 16 3120 -112
WIRE 3120 16 2864 16
WIRE 3408 16 3120 16
WIRE 4272 16 3568 16
WIRE 4480 16 4272 16
WIRE 4752 16 4752 -144
WIRE 4752 16 4640 16
WIRE 4800 16 4752 16
WIRE 320 160 320 16
WIRE 2192 160 2192 16
WIRE -1760 176 -1760 16
WIRE -608 176 -608 16
WIRE 3120 176 3120 16
WIRE 4272 176 4272 16
WIRE -2240 400 -2288 400
WIRE -2128 400 -2240 400
WIRE -1760 400 -1760 240
WIRE -1760 400 -1968 400
WIRE -1056 400 -1760 400
WIRE -608 400 -608 240
WIRE -608 400 -896 400
WIRE -368 400 -608 400
WIRE -128 400 -368 400
WIRE 320 400 320 224
WIRE 320 400 32 400
WIRE 592 400 320 400
WIRE 832 400 752 400
WIRE 912 400 832 400
WIRE 1680 400 1600 400
WIRE 1760 400 1680 400
WIRE 2192 400 2192 224
WIRE 2192 400 1920 400
WIRE 2480 400 2192 400
WIRE 2864 400 2640 400
WIRE 3120 400 3120 240
WIRE 3120 400 2864 400
WIRE 3408 400 3120 400
WIRE 4272 400 4272 240
WIRE 4272 400 3568 400
WIRE 4480 400 4272 400
WIRE 4752 400 4640 400
WIRE 4800 400 4752 400
WIRE -608 544 -608 400
WIRE 3120 544 3120 400
WIRE -2240 592 -2240 400
WIRE -2096 592 -2240 592
WIRE -1168 592 -1760 592
WIRE -736 592 -1088 592
WIRE 3600 592 3248 592
WIRE 4272 592 3680 592
WIRE 4752 592 4752 400
WIRE 4752 592 4608 592
WIRE -368 608 -368 400
WIRE -272 608 -368 608
WIRE 320 608 320 400
WIRE 320 608 -192 608
WIRE 832 608 832 400
WIRE 832 608 720 608
WIRE 1680 608 1680 400
WIRE 1792 608 1680 608
WIRE 2192 608 2192 400
WIRE 2704 608 2192 608
WIRE 2864 608 2864 400
WIRE 2864 608 2784 608
WIRE 2880 608 2864 608
WIRE -736 720 -736 592
WIRE -736 720 -1104 720
WIRE -96 720 -464 720
WIRE 2976 720 2608 720
WIRE 3248 720 3248 592
WIRE 3616 720 3248 720
WIRE -1104 848 -1104 720
WIRE -1040 848 -1104 848
WIRE -736 848 -736 720
WIRE -736 848 -880 848
WIRE -464 848 -464 720
WIRE -320 848 -464 848
WIRE -96 848 -96 720
WIRE -96 848 -160 848
WIRE 2608 848 2608 720
WIRE 2672 848 2608 848
WIRE 2976 848 2976 720
WIRE 2976 848 2832 848
WIRE 3248 848 3248 720
WIRE 3392 848 3248 848
WIRE 3616 848 3616 720
WIRE 3616 848 3552 848
FLAG -2288 16 Vocm_ref
IOPIN -2288 16 In
FLAG -608 -112 Vop
IOPIN -608 -112 In
FLAG -1968 -32 Vdd
IOPIN -1968 -32 In
FLAG -896 -32 Vdd
IOPIN -896 -32 In
FLAG -896 352 Vdd
IOPIN -896 352 In
FLAG -1968 352 Vdd
IOPIN -1968 352 In
FLAG -2128 -32 CK_PHI2
IOPIN -2128 -32 In
FLAG -2128 352 CK_PHI2
IOPIN -2128 352 In
FLAG -1056 -32 CK_PHI1
IOPIN -1056 -32 In
FLAG -1056 352 CK_PHI1
IOPIN -1056 352 In
FLAG -2128 64 CK_PHI2_BAR
IOPIN -2128 64 In
FLAG -2128 448 CK_PHI2_BAR
IOPIN -2128 448 In
FLAG -1056 64 CK_PHI1_BAR
IOPIN -1056 64 In
FLAG -1056 448 CK_PHI1_BAR
IOPIN -1056 448 In
FLAG -2288 400 Vbias
IOPIN -2288 400 In
FLAG -608 544 Vctr
IOPIN -608 544 Out
FLAG -160 896 Vdd
IOPIN -160 896 In
FLAG -320 896 CK_PHI2_BAR
IOPIN -320 896 In
FLAG -320 800 CK_PHI2
IOPIN -320 800 In
FLAG -1040 896 Vdd
IOPIN -1040 896 In
FLAG -880 896 CK_PHI1_BAR
IOPIN -880 896 In
FLAG -880 800 CK_PHI1
IOPIN -880 800 In
FLAG 32 -32 Vdd
IOPIN 32 -32 In
FLAG 32 352 Vdd
IOPIN 32 352 In
FLAG -128 -32 CK_PHI2
IOPIN -128 -32 In
FLAG -128 352 CK_PHI2
IOPIN -128 352 In
FLAG -128 64 CK_PHI2_BAR
IOPIN -128 64 In
FLAG -128 448 CK_PHI2_BAR
IOPIN -128 448 In
FLAG 912 16 Vocm_ref
IOPIN 912 16 In
FLAG 592 -32 Vdd
IOPIN 592 -32 In
FLAG 592 352 Vdd
IOPIN 592 352 In
FLAG 752 -32 CK_PHI1
IOPIN 752 -32 In
FLAG 752 352 CK_PHI1
IOPIN 752 352 In
FLAG 752 64 CK_PHI1_BAR
IOPIN 752 64 In
FLAG 752 448 CK_PHI1_BAR
IOPIN 752 448 In
FLAG 912 400 Vbias
IOPIN 912 400 In
FLAG -160 -416 Vdd
IOPIN -160 -416 In
FLAG -320 -416 CK_PHI2_BAR
IOPIN -320 -416 In
FLAG -320 -320 CK_PHI2
IOPIN -320 -320 In
FLAG -1040 -416 Vdd
IOPIN -1040 -416 In
FLAG -880 -416 CK_PHI1_BAR
IOPIN -880 -416 In
FLAG -880 -320 CK_PHI1
IOPIN -880 -320 In
FLAG 4800 16 Vocm_ref
IOPIN 4800 16 In
FLAG 3120 -112 Vom
IOPIN 3120 -112 In
FLAG 4480 -32 Vdd
IOPIN 4480 -32 In
FLAG 3408 -32 Vdd
IOPIN 3408 -32 In
FLAG 3408 352 Vdd
IOPIN 3408 352 In
FLAG 4480 352 Vdd
IOPIN 4480 352 In
FLAG 4640 -32 CK_PHI2
IOPIN 4640 -32 In
FLAG 4640 352 CK_PHI2
IOPIN 4640 352 In
FLAG 3568 -32 CK_PHI1
IOPIN 3568 -32 In
FLAG 3568 352 CK_PHI1
IOPIN 3568 352 In
FLAG 4640 64 CK_PHI2_BAR
IOPIN 4640 64 In
FLAG 4640 448 CK_PHI2_BAR
IOPIN 4640 448 In
FLAG 3568 64 CK_PHI1_BAR
IOPIN 3568 64 In
FLAG 3568 448 CK_PHI1_BAR
IOPIN 3568 448 In
FLAG 4800 400 Vbias
IOPIN 4800 400 In
FLAG 3120 544 Vctr
IOPIN 3120 544 Out
FLAG 2672 896 Vdd
IOPIN 2672 896 In
FLAG 2832 896 CK_PHI2_BAR
IOPIN 2832 896 In
FLAG 2832 800 CK_PHI2
IOPIN 2832 800 In
FLAG 3552 896 Vdd
IOPIN 3552 896 In
FLAG 3392 896 CK_PHI1_BAR
IOPIN 3392 896 In
FLAG 3392 800 CK_PHI1
IOPIN 3392 800 In
FLAG 2480 -32 Vdd
IOPIN 2480 -32 In
FLAG 2480 352 Vdd
IOPIN 2480 352 In
FLAG 2640 -32 CK_PHI2
IOPIN 2640 -32 In
FLAG 2640 352 CK_PHI2
IOPIN 2640 352 In
FLAG 2640 64 CK_PHI2_BAR
IOPIN 2640 64 In
FLAG 2640 448 CK_PHI2_BAR
IOPIN 2640 448 In
FLAG 1600 16 Vocm_ref
IOPIN 1600 16 In
FLAG 1920 -32 Vdd
IOPIN 1920 -32 In
FLAG 1920 352 Vdd
IOPIN 1920 352 In
FLAG 1760 -32 CK_PHI1
IOPIN 1760 -32 In
FLAG 1760 352 CK_PHI1
IOPIN 1760 352 In
FLAG 1760 64 CK_PHI1_BAR
IOPIN 1760 64 In
FLAG 1760 448 CK_PHI1_BAR
IOPIN 1760 448 In
FLAG 1600 400 Vbias
IOPIN 1600 400 In
FLAG 2672 -416 Vdd
IOPIN 2672 -416 In
FLAG 2832 -416 CK_PHI2_BAR
IOPIN 2832 -416 In
FLAG 2832 -320 CK_PHI2
IOPIN 2832 -320 In
FLAG 3552 -416 Vdd
IOPIN 3552 -416 In
FLAG 3392 -416 CK_PHI1_BAR
IOPIN 3392 -416 In
FLAG 3392 -320 CK_PHI1
IOPIN 3392 -320 In
SYMBOL tgate -976 16 R0
SYMATTR InstName X1
SYMBOL tgate -976 400 R0
SYMATTR InstName X2
SYMBOL tgate -2048 16 R0
SYMATTR InstName X3
SYMBOL tgate -2048 400 R0
SYMATTR InstName X4
SYMBOL cap -1776 176 R0
SYMATTR InstName C1
SYMATTR Value {C1}
SYMBOL cap -624 176 R0
SYMATTR InstName C2
SYMATTR Value {C2}
SYMBOL tgate -240 848 M180
SYMATTR SpiceLine L=0.28u Wn={Wn_d} Wp={Wp_d} M=1
SYMATTR InstName X5
SYMBOL tgate -960 848 R180
SYMATTR SpiceLine L=0.28u Wn={Wn_d} Wp={Wp_d} M=1
SYMATTR InstName X11
SYMBOL tgate -48 16 R0
SYMATTR InstName X7
SYMBOL tgate -48 400 R0
SYMATTR InstName X8
SYMBOL tgate 672 16 M0
SYMATTR InstName X9
SYMBOL tgate 672 400 M0
SYMATTR InstName X10
SYMBOL cap 304 160 R0
SYMATTR InstName C3
SYMATTR Value {C1}
SYMBOL tgate -240 -368 R0
SYMATTR SpiceLine L=0.28u Wn={Wn_d} Wp={Wp_d} M=1
SYMATTR InstName X21
SYMBOL tgate -960 -368 M0
SYMATTR SpiceLine L=0.28u Wn={Wn_d} Wp={Wp_d} M=1
SYMATTR InstName X22
SYMBOL res -1072 576 R90
WINDOW 0 0 56 VBottom 2
WINDOW 3 32 56 VTop 2
SYMATTR InstName R1
SYMATTR Value 1000G
SYMBOL res -176 592 R90
WINDOW 0 0 56 VBottom 2
WINDOW 3 32 56 VTop 2
SYMATTR InstName R2
SYMATTR Value 1000G
SYMBOL res -1072 -160 R90
WINDOW 0 0 56 VBottom 2
WINDOW 3 32 56 VTop 2
SYMATTR InstName R3
SYMATTR Value 1000G
SYMBOL res -160 -160 R90
WINDOW 0 0 56 VBottom 2
WINDOW 3 32 56 VTop 2
SYMATTR InstName R4
SYMATTR Value 1000G
SYMBOL res 736 592 R90
WINDOW 0 0 56 VBottom 2
WINDOW 3 32 56 VTop 2
SYMATTR InstName R5
SYMATTR Value 1000G
SYMBOL res -2000 576 R90
WINDOW 0 0 56 VBottom 2
WINDOW 3 32 56 VTop 2
SYMATTR InstName R6
SYMATTR Value 1000G
SYMBOL res -2000 -160 R90
WINDOW 0 0 56 VBottom 2
WINDOW 3 32 56 VTop 2
SYMATTR InstName R7
SYMATTR Value 1000G
SYMBOL res 736 -160 R90
WINDOW 0 0 56 VBottom 2
WINDOW 3 32 56 VTop 2
SYMATTR InstName R8
SYMATTR Value 1000G
SYMBOL tgate 3488 16 M0
SYMATTR InstName X6
SYMBOL tgate 3488 400 M0
SYMATTR InstName X12
SYMBOL tgate 4560 16 M0
SYMATTR InstName X13
SYMBOL tgate 4560 400 M0
SYMATTR InstName X14
SYMBOL cap 4288 176 M0
SYMATTR InstName C4
SYMATTR Value {C1}
SYMBOL cap 3136 176 M0
SYMATTR InstName C5
SYMATTR Value {C2}
SYMBOL tgate 2752 848 R180
SYMATTR SpiceLine L=0.28u Wn={Wn_d} Wp={Wp_d} M=1
SYMATTR InstName X15
SYMBOL tgate 3472 848 M180
SYMATTR SpiceLine L=0.28u Wn={Wn_d} Wp={Wp_d} M=1
SYMATTR InstName X16
SYMBOL tgate 2560 16 M0
SYMATTR InstName X17
SYMBOL tgate 2560 400 M0
SYMATTR InstName X18
SYMBOL tgate 1840 16 R0
SYMATTR InstName X19
SYMBOL tgate 1840 400 R0
SYMATTR InstName X20
SYMBOL cap 2208 160 M0
SYMATTR InstName C6
SYMATTR Value {C1}
SYMBOL tgate 2752 -368 M0
SYMATTR SpiceLine L=0.28u Wn={Wn_d} Wp={Wp_d} M=1
SYMATTR InstName X23
SYMBOL tgate 3472 -368 R0
SYMATTR SpiceLine L=0.28u Wn={Wn_d} Wp={Wp_d} M=1
SYMATTR InstName X24
SYMBOL res 3584 576 M90
WINDOW 0 0 56 VBottom 2
WINDOW 3 32 56 VTop 2
SYMATTR InstName R9
SYMATTR Value 1000G
SYMBOL res 2688 592 M90
WINDOW 0 0 56 VBottom 2
WINDOW 3 32 56 VTop 2
SYMATTR InstName R10
SYMATTR Value 1000G
SYMBOL res 3584 -160 M90
WINDOW 0 0 56 VBottom 2
WINDOW 3 32 56 VTop 2
SYMATTR InstName R11
SYMATTR Value 1000G
SYMBOL res 2672 -160 M90
WINDOW 0 0 56 VBottom 2
WINDOW 3 32 56 VTop 2
SYMATTR InstName R12
SYMATTR Value 1000G
SYMBOL res 1776 592 M90
WINDOW 0 0 56 VBottom 2
WINDOW 3 32 56 VTop 2
SYMATTR InstName R13
SYMATTR Value 1000G
SYMBOL res 4512 576 M90
WINDOW 0 0 56 VBottom 2
WINDOW 3 32 56 VTop 2
SYMATTR InstName R14
SYMATTR Value 1000G
SYMBOL res 4512 -160 M90
WINDOW 0 0 56 VBottom 2
WINDOW 3 32 56 VTop 2
SYMATTR InstName R15
SYMATTR Value 1000G
SYMBOL res 1776 -160 M90
WINDOW 0 0 56 VBottom 2
WINDOW 3 32 56 VTop 2
SYMATTR InstName R16
SYMATTR Value 1000G
TEXT -1064 -120 Left 2 ;PHI2
TEXT -992 504 Left 2 ;PHI2
TEXT -2072 -112 Left 2 ;PHI1
TEXT -2072 528 Left 2 ;PHI1
TEXT -1720 -584 Left 2 !.param C1=20f C2=20f/10
TEXT -1744 -624 Left 2 ;All SWITCHES ARE TRANSMISSION GATES 3:1
TEXT -1720 -528 Left 2 !.param Wn_d=1u/2 Wp_d=3u/2
TEXT -136 -104 Left 2 ;PHI2
TEXT -64 504 Left 2 ;PHI2
TEXT 696 -112 Right 2 ;PHI1
TEXT 696 528 Right 2 ;PHI1
TEXT -256 -264 Left 2 ;PHI2
TEXT -944 -264 Right 2 ;PHI2
TEXT 3576 -120 Right 2 ;PHI2
TEXT 3504 504 Right 2 ;PHI2
TEXT 4584 -112 Right 2 ;PHI1
TEXT 4584 528 Right 2 ;PHI1
TEXT 2648 -104 Right 2 ;PHI2
TEXT 2576 504 Right 2 ;PHI2
TEXT 1816 -112 Left 2 ;PHI1
TEXT 1816 528 Left 2 ;PHI1
TEXT 2768 -264 Right 2 ;PHI2
TEXT 3456 -264 Left 2 ;PHI2

The netlist it stands for:
* ota_v4.asc
M1 Vdd vm3 N002 Vdd pmos_3p3 l='Lmirr' w='W5' m=Mcopy_fold
M2 N002 Vb2 vm3 Vdd pmos_3p3 l='Lcas' w='W3' m=Mcopy_cas
M3 N006 vm2 0 0 nmos_3p3 l='Lmirr' w='W9' m=Mcopy_cas
M4 vm2 Vb1 N006 0 nmos_3p3 l='Lcas' w='W7' m=Mcopy_cas
M5 Vb1 a vm2 0 nmos_3p3 l='Lcas' w='(1/6)*W7' m=Mcopy_cas
M6 a a Vb1 0 nmos_3p3 l='Lcas' w='W7' m=Mcopy_cas
M7 vm3 c Vb2 Vdd pmos_3p3 l='Lcas' w='(1/5)*W3' m=Mcopy_cas
M8 Vb2 c c Vdd pmos_3p3 l='Lcas' w='W3' m=Mcopy_cas
M9 X Vip N003 0 nmos_3p3 l='Lpair' w='Wpair' m=1
M10 Y Vim N003 0 nmos_3p3 l='Lpair' w='Wpair' m=1
M11 N003 vm1 0 0 nmos_3p3 l='Ltail' w='Wtail' m=1
M12 vm1 vm1 0 0 nmos_3p3 l='Ltail' w='Wtail' m=Mcopy_tail
M13 Vdd vm3 X Vdd pmos_3p3 l='Lmirr' w='W5' m=1
M14 X Vb2 Vom Vdd pmos_3p3 l='Lcas' w='W3' m=1
M15 Vom Vb1 N007 0 nmos_3p3 l='Lcas' w='W7'
M16 N007 vm2 0 0 nmos_3p3 l='Lmirr' w='a*W9'
M17 Vdd vm3 Y Vdd pmos_3p3 l='Lmirr' w='W5' m=1
M18 Y Vb2 Vop Vdd pmos_3p3 l='Lcas' w='W3' m=1
M19 Vop Vb1 N008 0 nmos_3p3 l='Lcas' w='W7'
M20 N008 vm2 0 0 nmos_3p3 l='Lmirr' w='a*W9'
M21 N007 vctr 0 0 nmos_3p3 l='Lmirr' w='(1-a)*W9'
M22 N008 vctr 0 0 nmos_3p3 l='Lmirr' w='(1-a)*W9'
C1 Vom 0 100f
C2 Vop 0 100f
M23 N005 vm1 0 0 nmos_3p3 l='Ltail' w='Wtail' m=Mcopy_tail
M24 Vdd N005 N005 Vdd pmos_3p3 l='Lcopy' w='Wcopy_p'
M25 Vdd N005 a Vdd pmos_3p3 l='Lcopy' w='Wcopy_p'
M26 c vm1 0 0 nmos_3p3 l='Ltail' w='Wtail' m=Mcopy_tail
M27 N004 N004 vm1 0 nmos_3p3 l='Ltail' w=2.64u m=3
M28 Vdd N001 N001 Vdd pmos_3p3 l='Ltail' w='Wcopy_p'
R3 N001 N004 45833.33
XX1 CK_MASTER Vdd CK_PHI1 CK_PHI1_BAR CK_PHI2 CK_PHI2_BAR phase_gen
XX2 CK_PHI1 CK_PHI1_BAR CK_PHI2 CK_PHI2_BAR vm2 Vdd Vocm_target Vom Vop vctr cs_cmfb_v2

* block symbol definitions
.subckt phase_gen CK Vdd CK1 CK1_BAR CK2 CK2_BAR
XX1 CK CK2_FB Vdd 0 N001 nor2x1
XX2 CK Vdd CK_BAR 0 invx1
XX5 CK_BAR CK1_FB Vdd 0 N006 nor2x1
XX6 CK2 Vdd N008 0 invx1
XX7 N008 Vdd N009 0 invx1
XX8 N001 Vdd CK1_BAR 0 invx1
XX9 N006 Vdd CK2_BAR 0 invx1
XX10 N009 Vdd N010 0 invx1
XX11 N010 Vdd CK2_FB 0 invx1
XX3 CK1 Vdd N003 0 invx1
XX4 N003 Vdd N004 0 invx1
XX12 N004 Vdd N005 0 invx1
XX13 N005 Vdd CK1_FB 0 invx1
XX14 Vdd 0 N001 Vdd N002 tgate L=0.28u Wn=1u Wp=3u M={M}  ; pins A A_bar IN Vdd OUT
XX15 Vdd 0 N006 Vdd N007 tgate L=0.28u Wn=1u Wp=3u M={M}  ; pins A A_bar IN Vdd OUT
XX16 Vdd 0 N002 Vdd CK1 tgate L=0.28u Wn=1u Wp=3u M={M}  ; pins A A_bar IN Vdd OUT
XX17 Vdd 0 N007 Vdd CK2 tgate L=0.28u Wn=1u Wp=3u M={M}  ; pins A A_bar IN Vdd OUT
.param M=1
.ends phase_gen

.subckt nor2x1 A B Vdd Vee X
M1 X B Vee Vee nmos_3p3 l={L} w={Wn}
M3 N001 A X Vdd pmos_3p3 l={L} w={Wp}
M4 Vdd B N001 Vdd pmos_3p3 l={L} w={Wp}
M2 X A Vee Vee nmos_3p3 l={L} w={Wn}
.param Wp=6u Wn=1u L=0.28u
.ends nor2x1

.subckt invx1 A Vdd X Vee
M1 X A Vee Vee nmos_3p3 l={L} w={Wn}
M2 Vdd A X Vdd pmos_3p3 l={L} w={Wp}
.param Wp=3u Wn=1u L=0.28u
.ends invx1

.subckt cs_cmfb_v2 CK_PHI1 CK_PHI1_BAR CK_PHI2 CK_PHI2_BAR Vbias Vdd Vocm_ref Vom Vop Vctr
XX1 CK_PHI1 CK_PHI1_BAR N009 Vdd Vop tgate L=0.28u Wn=1u Wp=3u M=1  ; pins A A_bar IN Vdd OUT
XX2 CK_PHI1 CK_PHI1_BAR N011 Vdd Vctr tgate L=0.28u Wn=1u Wp=3u M=1  ; pins A A_bar IN Vdd OUT
XX3 CK_PHI2 CK_PHI2_BAR Vocm_ref Vdd N009 tgate L=0.28u Wn=1u Wp=3u M=1  ; pins A A_bar IN Vdd OUT
XX4 CK_PHI2 CK_PHI2_BAR Vbias Vdd N011 tgate L=0.28u Wn=1u Wp=3u M=1  ; pins A A_bar IN Vdd OUT
C1 N009 N011 {C1}
C2 Vop Vctr {C2}
XX5 CK_PHI2_BAR CK_PHI2 N019 Vdd N019 tgate L=0.28u Wn={Wn_d} Wp={Wp_d} M=1  ; pins A A_bar IN Vdd OUT
XX11 CK_PHI1_BAR CK_PHI1 N016 Vdd N016 tgate L=0.28u Wn={Wn_d} Wp={Wp_d} M=1  ; pins A A_bar IN Vdd OUT
XX7 CK_PHI2 CK_PHI2_BAR Vop Vdd N006 tgate L=0.28u Wn=1u Wp=3u M=1  ; pins A A_bar IN Vdd OUT
XX8 CK_PHI2 CK_PHI2_BAR Vctr Vdd N012 tgate L=0.28u Wn=1u Wp=3u M=1  ; pins A A_bar IN Vdd OUT
XX9 CK_PHI1 CK_PHI1_BAR Vocm_ref Vdd N006 tgate L=0.28u Wn=1u Wp=3u M=1  ; pins A A_bar IN Vdd OUT
XX10 CK_PHI1 CK_PHI1_BAR Vbias Vdd N012 tgate L=0.28u Wn=1u Wp=3u M=1  ; pins A A_bar IN Vdd OUT
C3 N006 N012 {C1}
XX21 CK_PHI2_BAR CK_PHI2 N002 Vdd N002 tgate L=0.28u Wn={Wn_d} Wp={Wp_d} M=1  ; pins A A_bar IN Vdd OUT
XX22 CK_PHI1_BAR CK_PHI1 N001 Vdd N001 tgate L=0.28u Wn={Wn_d} Wp={Wp_d} M=1  ; pins A A_bar IN Vdd OUT
R1 N016 N015 1000G
R2 N012 Vctr 1000G
R3 Vop N005 1000G
R4 N006 Vop 1000G
R5 Vbias NC_01 1000G
R6 NC_02 Vbias 1000G
R7 NC_03 Vocm_ref 1000G
R8 Vocm_ref NC_04 1000G
XX6 CK_PHI1 CK_PHI1_BAR N010 Vdd Vom tgate L=0.28u Wn=1u Wp=3u M=1  ; pins A A_bar IN Vdd OUT
XX12 CK_PHI1 CK_PHI1_BAR N014 Vdd Vctr tgate L=0.28u Wn=1u Wp=3u M=1  ; pins A A_bar IN Vdd OUT
XX13 CK_PHI2 CK_PHI2_BAR Vocm_ref Vdd N010 tgate L=0.28u Wn=1u Wp=3u M=1  ; pins A A_bar IN Vdd OUT
XX14 CK_PHI2 CK_PHI2_BAR Vbias Vdd N014 tgate L=0.28u Wn=1u Wp=3u M=1  ; pins A A_bar IN Vdd OUT
C4 N010 N014 {C1}
C5 Vom Vctr {C2}
XX15 CK_PHI2_BAR CK_PHI2 N020 Vdd N020 tgate L=0.28u Wn={Wn_d} Wp={Wp_d} M=1  ; pins A A_bar IN Vdd OUT
XX16 CK_PHI1_BAR CK_PHI1 N017 Vdd N017 tgate L=0.28u Wn={Wn_d} Wp={Wp_d} M=1  ; pins A A_bar IN Vdd OUT
XX17 CK_PHI2 CK_PHI2_BAR Vom Vdd N007 tgate L=0.28u Wn=1u Wp=3u M=1  ; pins A A_bar IN Vdd OUT
XX18 CK_PHI2 CK_PHI2_BAR Vctr Vdd N013 tgate L=0.28u Wn=1u Wp=3u M=1  ; pins A A_bar IN Vdd OUT
XX19 CK_PHI1 CK_PHI1_BAR Vocm_ref Vdd N007 tgate L=0.28u Wn=1u Wp=3u M=1  ; pins A A_bar IN Vdd OUT
XX20 CK_PHI1 CK_PHI1_BAR Vbias Vdd N013 tgate L=0.28u Wn=1u Wp=3u M=1  ; pins A A_bar IN Vdd OUT
C6 N007 N013 {C1}
XX23 CK_PHI2_BAR CK_PHI2 N003 Vdd N003 tgate L=0.28u Wn={Wn_d} Wp={Wp_d} M=1  ; pins A A_bar IN Vdd OUT
XX24 CK_PHI1_BAR CK_PHI1 N004 Vdd N004 tgate L=0.28u Wn={Wn_d} Wp={Wp_d} M=1  ; pins A A_bar IN Vdd OUT
R9 N017 N018 1000G
R10 N013 Vctr 1000G
R11 N004 N008 1000G
R12 N007 Vom 1000G
R13 Vbias NC_05 1000G
R14 NC_06 Vbias 1000G
R15 NC_07 Vocm_ref 1000G
R16 Vocm_ref NC_08 1000G
* PHI2
* PHI2
* PHI1
* PHI1
.param C1=20f C2=20f/10
* All SWITCHES ARE TRANSMISSION GATES 3:1
.param Wn_d=1u/2 Wp_d=3u/2
* PHI2
* PHI2
* PHI1
* PHI1
* PHI2
* PHI2
* PHI2
* PHI2
* PHI1
* PHI1
* PHI2
* PHI2
* PHI1
* PHI1
* PHI2
* PHI2
.ends cs_cmfb_v2

.model NMOS NMOS
.model PMOS PMOS
.lib standard.mos
.param Wpair=12.63u Lpair=0.28u
.param Wtail=2.64u Ltail=4.48u
.param vid=0 Vicm=1.65
.inc ..\..\gf180\cmos_tt.txt
* .op
.param W5=22.99u W3=7.92u W7=1.92u W9=3.53u Lmirr=2.24u Lcas=0.84u
.param Vocm_target=1.65
* .tran 3u
.param a=0.7
.ac dec 1000 1 10G
* .dc param vid -40m 40m 100u
.meas dc_gain max mag(V(vop)-V(vom))
.meas ac bw find mag(V(vop)-V(vom)) when mag(V(vop)-V(vom))=dc_gain/sqrt(2)
.meas GBW dc_gain * bw
.param Lcopy=4.48u Wcopy_p=35.91u
* Master CURRENT BRANCH
* - M12 copies current to tail transistor. (6uA -> 2uA)
* - M26 copies current to cascode NMOS current mirrors. (6uA -> 6uA)
* - M24, M25 copies current to cascode PMOS. (6uA -> 6uA)
* - All NMOS transistors have W=Wtail; L=Ltail; M=Mcopy_tail
* - All PMOS transistros havw W=Wcopy_p L=copy
* INPUT DIFFERENTIAL PAIR
* - gm/Id pair: 23.8
* - gm/Id tail: 8
* .noise V(vop,vom) V3 dec 1000 1 30k
.meas noise VNOISE_RMS integ V(onoise)
.meas DC vo_swing FIND V(vop,vom) WHEN deriv(V(vop,vom))=500
.meas ac av_dc_dm AVG V(vop,vom) from=1 to=10
.param Mn=2 Mp=4 Mcopy_tail=3
.param Mcopy_cas=3 Mcopy_fold=2
* CURRENT MIRROR FOR CASCODE BRANCH
* - Mcopy_cas: 6uA -> 2uA
* - Mcopy_fold: 6uA -> 3uA
* COPIES CURRENT TO PMOS CASCODE BRANCH
* COPIES CURRENT TO NMOS CASCODE BRANCH
.measure tran iavg AVG i(V1) from=4u to=5u
.measure tran iclk_phi2_avg AVG i(V6) from=4u to=5u
.measure tran iclk_phi1_avg AVG i(V7) from=4u to=5u
.measure tran pclk2 PARAM='-iclk_phi2_avg*3.3'
.measure tran pclk1 PARAM='-iclk_phi1_avg*3.3'
.measure tran pavg PARAM='-iavg*3.3'
.measure tran ptot PARAM='pavg+pclk1+pclk2'
* OUTPUT CASCODE BRANCH
* - gm/Id M13/17: 14
* - gm/Id M14/18: 12
* - gm/Id M15/19: 12
* - gm/Id M16/20: 14
* SC CMFB
* IDEAL CMFB JUST FOR TESTING (.AC, .DC, .OP, .NOISE)
* W13,17=W5
* L13,17=Lmirr
* W14,18=W3
* L14,18=Lcas
* W13,17=W7
* L13,17=Lcas
* W16,20=W9
* L16,20=Lmirr
* W6,4 = W7
* M6,4 = Mcopy_cas
* L6,4 = Lcas
* W5 = (1/6)W7
* M5 = Mcopy_cas
* L5 = Lcas
* W3 = W9
* M3 = Mcopy_cas
* L3 = Lmirr
* W2,8 = W3
* M2,8 = Mcopy_cas
* L2,8 = Lcas
* W7 = (1/5)W3
* M7 = Mcopy_cas
* L7 = Lcas
* W3 = W9
* M3 = Mcopy_cas
* L3 = Lmirr
* W9,10 = Wpair
* L9,10 = Lpair
* W11 = Wtail
* L11 = Ltail
* .op
;.ic V(Vctr)= 788.35945m
.backanno
.end